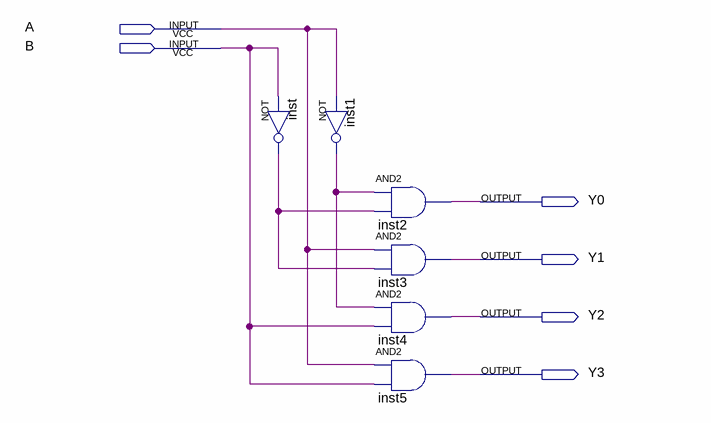
[diagram p0: schematic sheet]
// Quartus schematic CPLD_2to4_Decoder.bdf as structural Verilog: 6 symbols, 6 pins
module CPLD_2to4_Decoder (
  input  A,
  input  B,
  output Y0,
  output Y1,
  output Y2,
  output Y3
);

  wire inst1_out, inst_out;

  not inst (inst_out, B);
  not inst1 (inst1_out, A);
  and inst2 (Y0, inst1_out, inst_out);
  and inst3 (Y1, A, inst_out);
  and inst4 (Y2, inst1_out, B);
  and inst5 (Y3, A, B);
endmodule
